# Altium project Prototipo1.PrjPcb
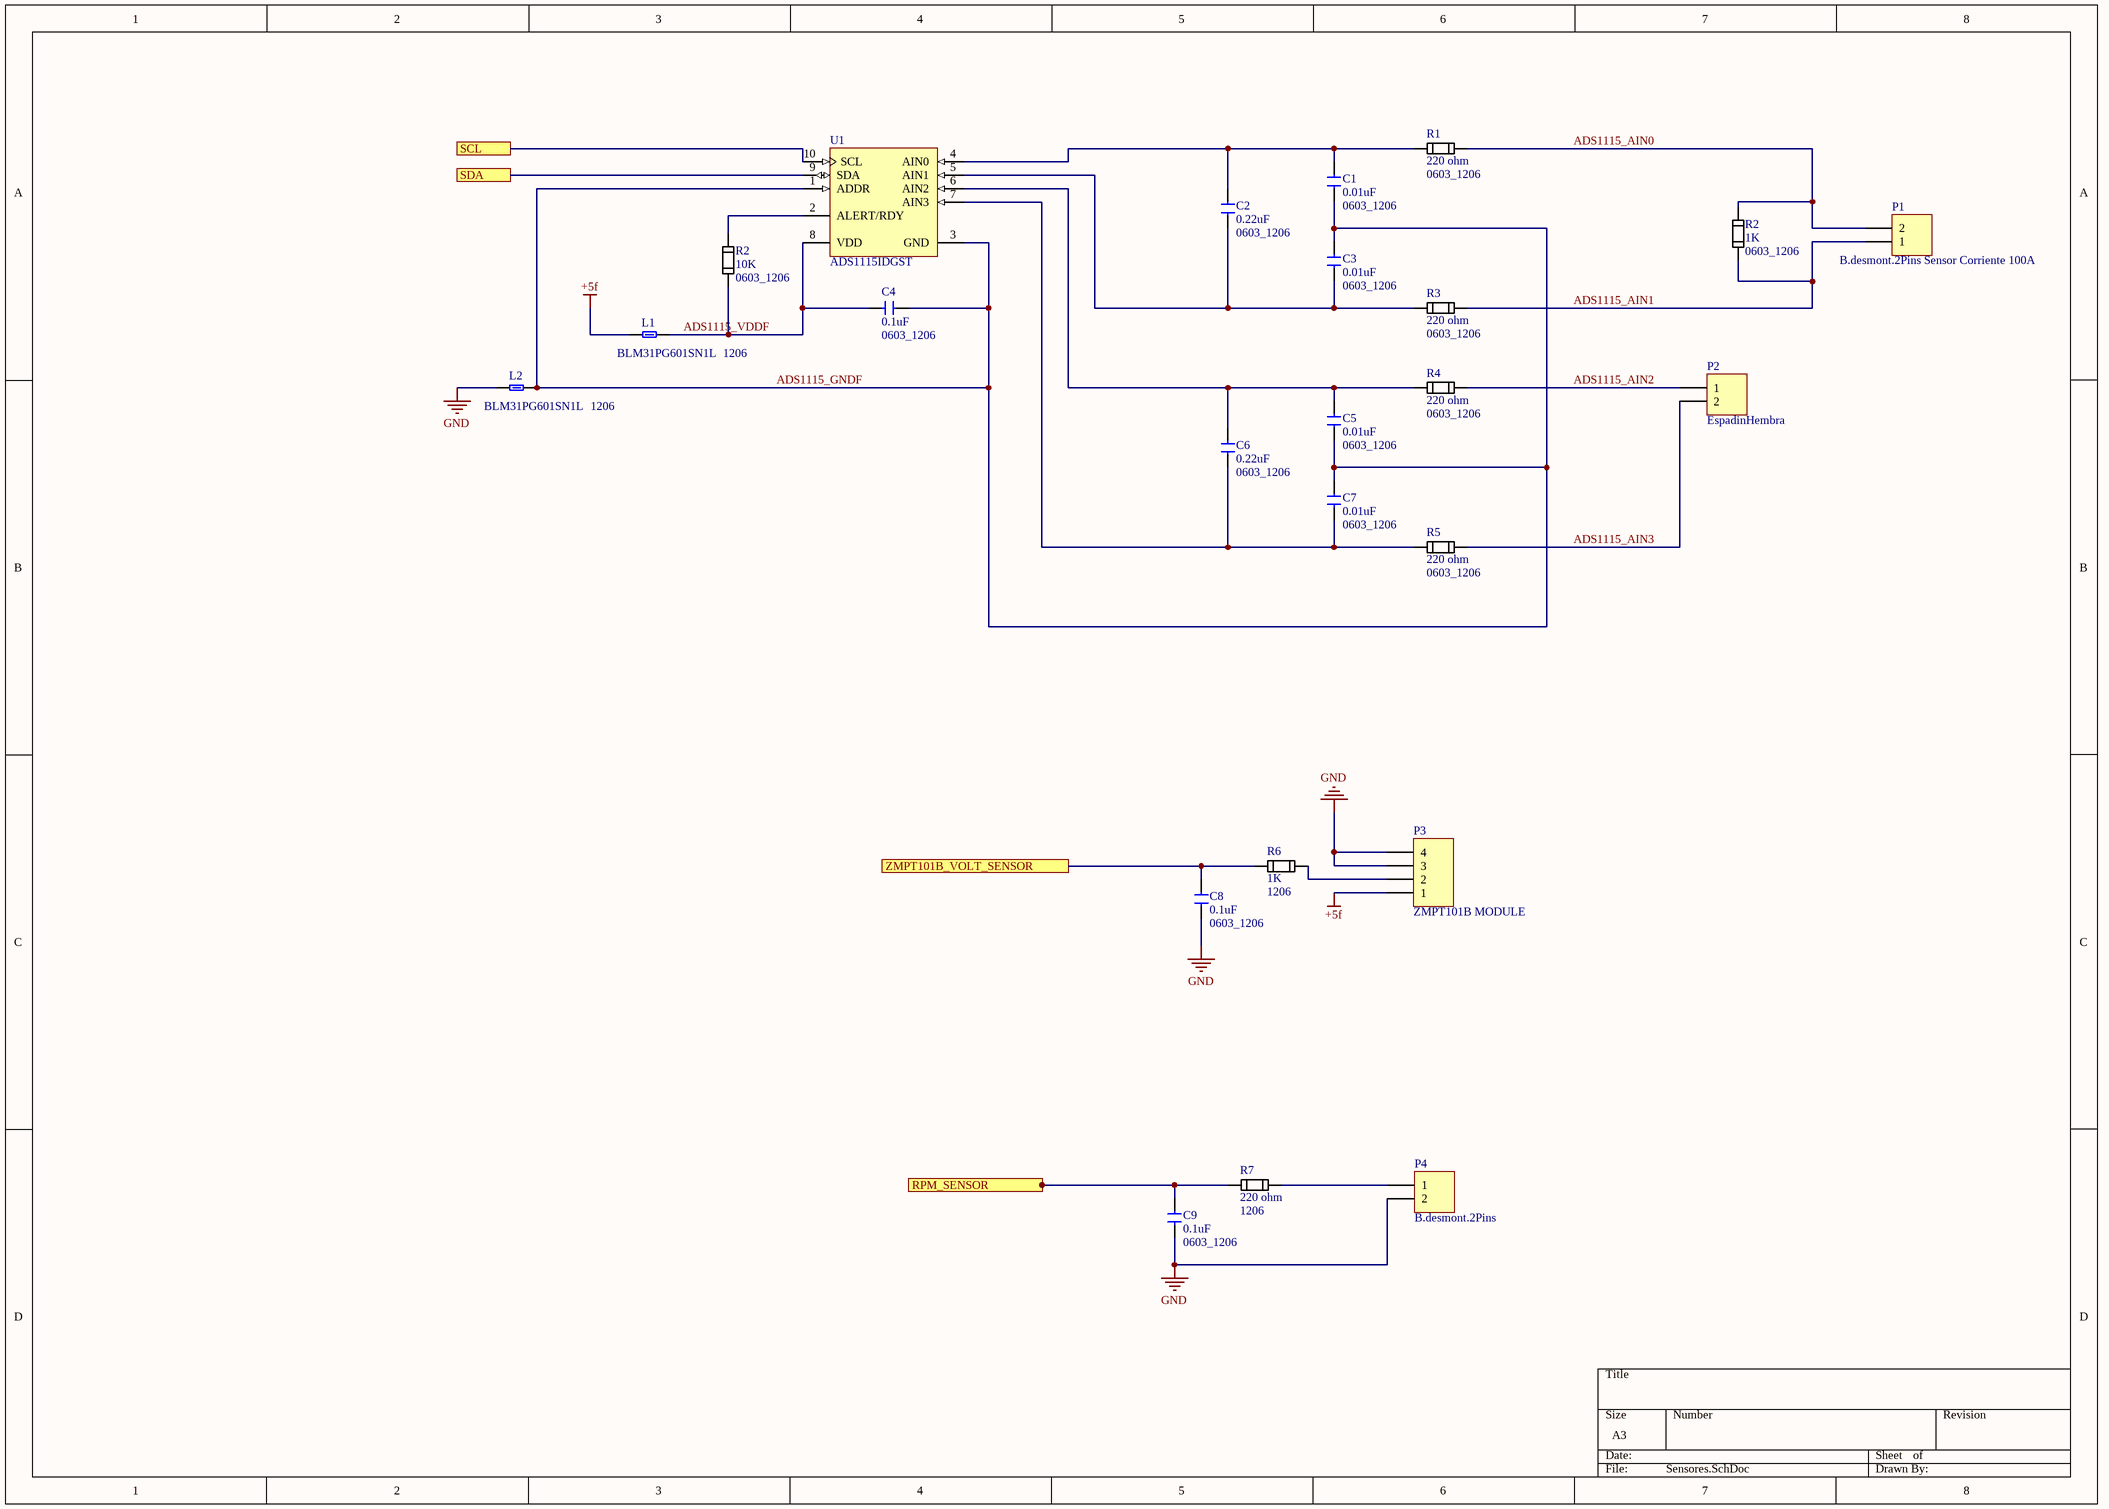
[diagram p0: Sensores.SchDoc]
6 sheets, 129 parts. Net scope: global (net labels, ports and power ports of the same name join across sheets).
Board file: Prototipo1A.PcbDoc
Sheets:
  Sensores.SchDoc
  uController.SchDoc
  SensorTemperatura.SchDoc
  Relay.SchDoc
  PowerSupply.SchDoc
  MAX3232.SchDoc

## Sheet Sensores.SchDoc
size A3

### Parts
(Parts that share a designator on the sheet are numbered #1, #2 ... from top to bottom, then left to right.)
C1  0.01uF  value 0603_1206  [SMD_CHIP_CAP_CER_0603_TO_1206]
C2  0.22uF  value 0603_1206  [SMD_CHIP_CAP_CER_0603_TO_1206]
C3  0.01uF  value 0603_1206  [SMD_CHIP_CAP_CER_0603_TO_1206]
C4  0.1uF  value 0603_1206  [SMD_CHIP_CAP_CER_0603_TO_1206]
C5  0.01uF  value 0603_1206  [SMD_CHIP_CAP_CER_0603_TO_1206]
C6  0.22uF  value 0603_1206  [SMD_CHIP_CAP_CER_0603_TO_1206]
C7  0.01uF  value 0603_1206  [SMD_CHIP_CAP_CER_0603_TO_1206]
C8  0.1uF  value 0603_1206  [SMD_CHIP_CAP_CER_0603_TO_1206]
C9  0.1uF  value 0603_1206  [SMD_CHIP_CAP_CER_0603_TO_1206]
L1  BLM31PG601SN1L  value 1206  [SMD_CHIP_FERRITE_1206]
L2  BLM31PG601SN1L  value 1206  [SMD_CHIP_FERRITE_1206]
P1  B.desmont.2Pins Sensor Corriente 100A  [KF2EDGV/R-2P]
P2  EspadinHembra  [HDR1X2]
P3  ZMPT101B MODULE  [ZMPT101B_MODULE]
P4  B.desmont.2Pins  [KF2EDGV/R-2P]
R1  220 ohm  value 0603_1206  [SMD_CHIP_RESISTOR_0603_TO_1206]
R2#1  1K  value 0603_1206  [SMD_CHIP_RESISTOR_0603_TO_1206]
R2#2  10K  value 0603_1206  [SMD_CHIP_RESISTOR_0603_TO_1206]
R3  220 ohm  value 0603_1206  [SMD_CHIP_RESISTOR_0603_TO_1206]
R4  220 ohm  value 0603_1206  [SMD_CHIP_RESISTOR_0603_TO_1206]
R5  220 ohm  value 0603_1206  [SMD_CHIP_RESISTOR_0603_TO_1206]
R6  1K  value 1206  [SMD_CHIP_RESISTOR_1206]
R7  220 ohm  value 1206  [SMD_CHIP_RESISTOR_1206]
U1  ADS1115IDGST  [TI-DGS10_L]

### Ports
RPM_SENSOR, SCL, SDA, ZMPT101B_VOLT_SENSOR

### Nets
+5f: L1.1 P3.1
GND: C8.1 C9.1 L2.1 P3.3 P3.4 P4.2
ADS1115_AIN0: P1.2 R1.2 R2#1.2
ADS1115_AIN1: P1.1 R2#1.1 R3.2
ADS1115_AIN2: P2.1 R4.2
ADS1115_AIN3: P2.2 R5.2
ADS1115_GNDF: C1.1 C3.2 C4.1 C5.1 C7.2 L2.2 U1.1(ADDR) U1.3(GND)
ADS1115_VDDF: C4.2 L1.2 R2#2.1 U1.8(VDD)
RPM_SENSOR: C9.2 R7.1 ; port RPM_SENSOR
SCL: U1.10(SCL) ; port SCL
SDA: U1.9(SDA) ; port SDA
ZMPT101B_VOLT_SENSOR: C8.2 R6.1 ; port ZMPT101B_VOLT_SENSOR
NetC1_2: C1.2 C2.2 R1.1 U1.4(AIN0)
NetC2_1: C2.1 C3.1 R3.1 U1.5(AIN1)
NetC5_2: C5.2 C6.2 R4.1 U1.6(AIN2)
NetC6_1: C6.1 C7.1 R5.1 U1.7(AIN3)
NetP3_2: P3.2 R6.2
NetP4_1: P4.1 R7.2
NetR2#2_2: R2#2.2 U1.2(ALERT/RDY)

### Library data of the parts
C1-C9 = SMD_CHIP_CAP_CER_0603_TO_1206
L1 L2 = CHIP_FERRITE_BEAD_INDUCTOR_1206: Chip Ferrite Bead Inductor
P1 P2 P4 = Header 2: Header, 2-Pin; LatestRevisionDate: 17-Jul-2002; LatestRevisionNote: Re-released for DXP Platform.; Publisher: Altium Limited
P3 = Header 4: Header, 4-Pin; LatestRevisionDate: 17-Jul-2002; LatestRevisionNote: Re-released for DXP Platform.; Publisher: Altium Limited
R1 R2#1 R2#2 R3-R5 = SMD_CHIP_RESISTOR_0603_TO_1206
R6 R7 = SMD_CHIP_RESISTOR_1206
U1 = CMP-0003-00378-2: 16-Bit ADC with Integrated Multiplexer, PGA, Comparator, Oscillator, and Reference, -40 to 125 degC, 10-pin SOP (DGS10), Green (RoHS & no Sb/Br); Manufacturer: Texas Instruments; Sample Rate (max)(SPS): 860; SubFamily: Precision ADC (<=10MSPS); Architecture: Delta-Sigma; Digital Supply(Min)(V): 2; Resolution(Bits): 16; Digital Supply(Max)(V): 5.5; INL(Max)(+/-LSB): 1; Interface: Serial I2C; # Input Channels: 4; Eco-Plan: Green (RoHS & no Sb/Br); PackageDescription: 10-Pin Plastic Small Outline, Body 3 x 3 mm, Pitch 0.5 mm; Mounting Technology: Surface Mount; PackageReference: DGS10; DatasheetVersion: SBAS444B; ComponentLink3Description: Package Specification; ComponentLink1Description: Manufacturer URL; PartNumber: ADS1115IDGST; ComponentLink3URL: http://www.ti.com/lit/ml/mpds035b/mpds035b.pdf; ComponentLink2URL: http://www.ti.com/general/docs/lit/getliterature.tsp?genericPartNumber=ADS1115&fileType=pdf; Analog Voltage AV/DD(Min)(V): 2; ComponentLink2Description: Datasheet; PackageVersion: 4073272/C, 02/2004; Analog Voltage AV/DD(Max)(V): 5.5; Code_JEDEC: MO-153; ComponentLink1URL: http://www.ti.com/

## Sheet uController.SchDoc
size A3
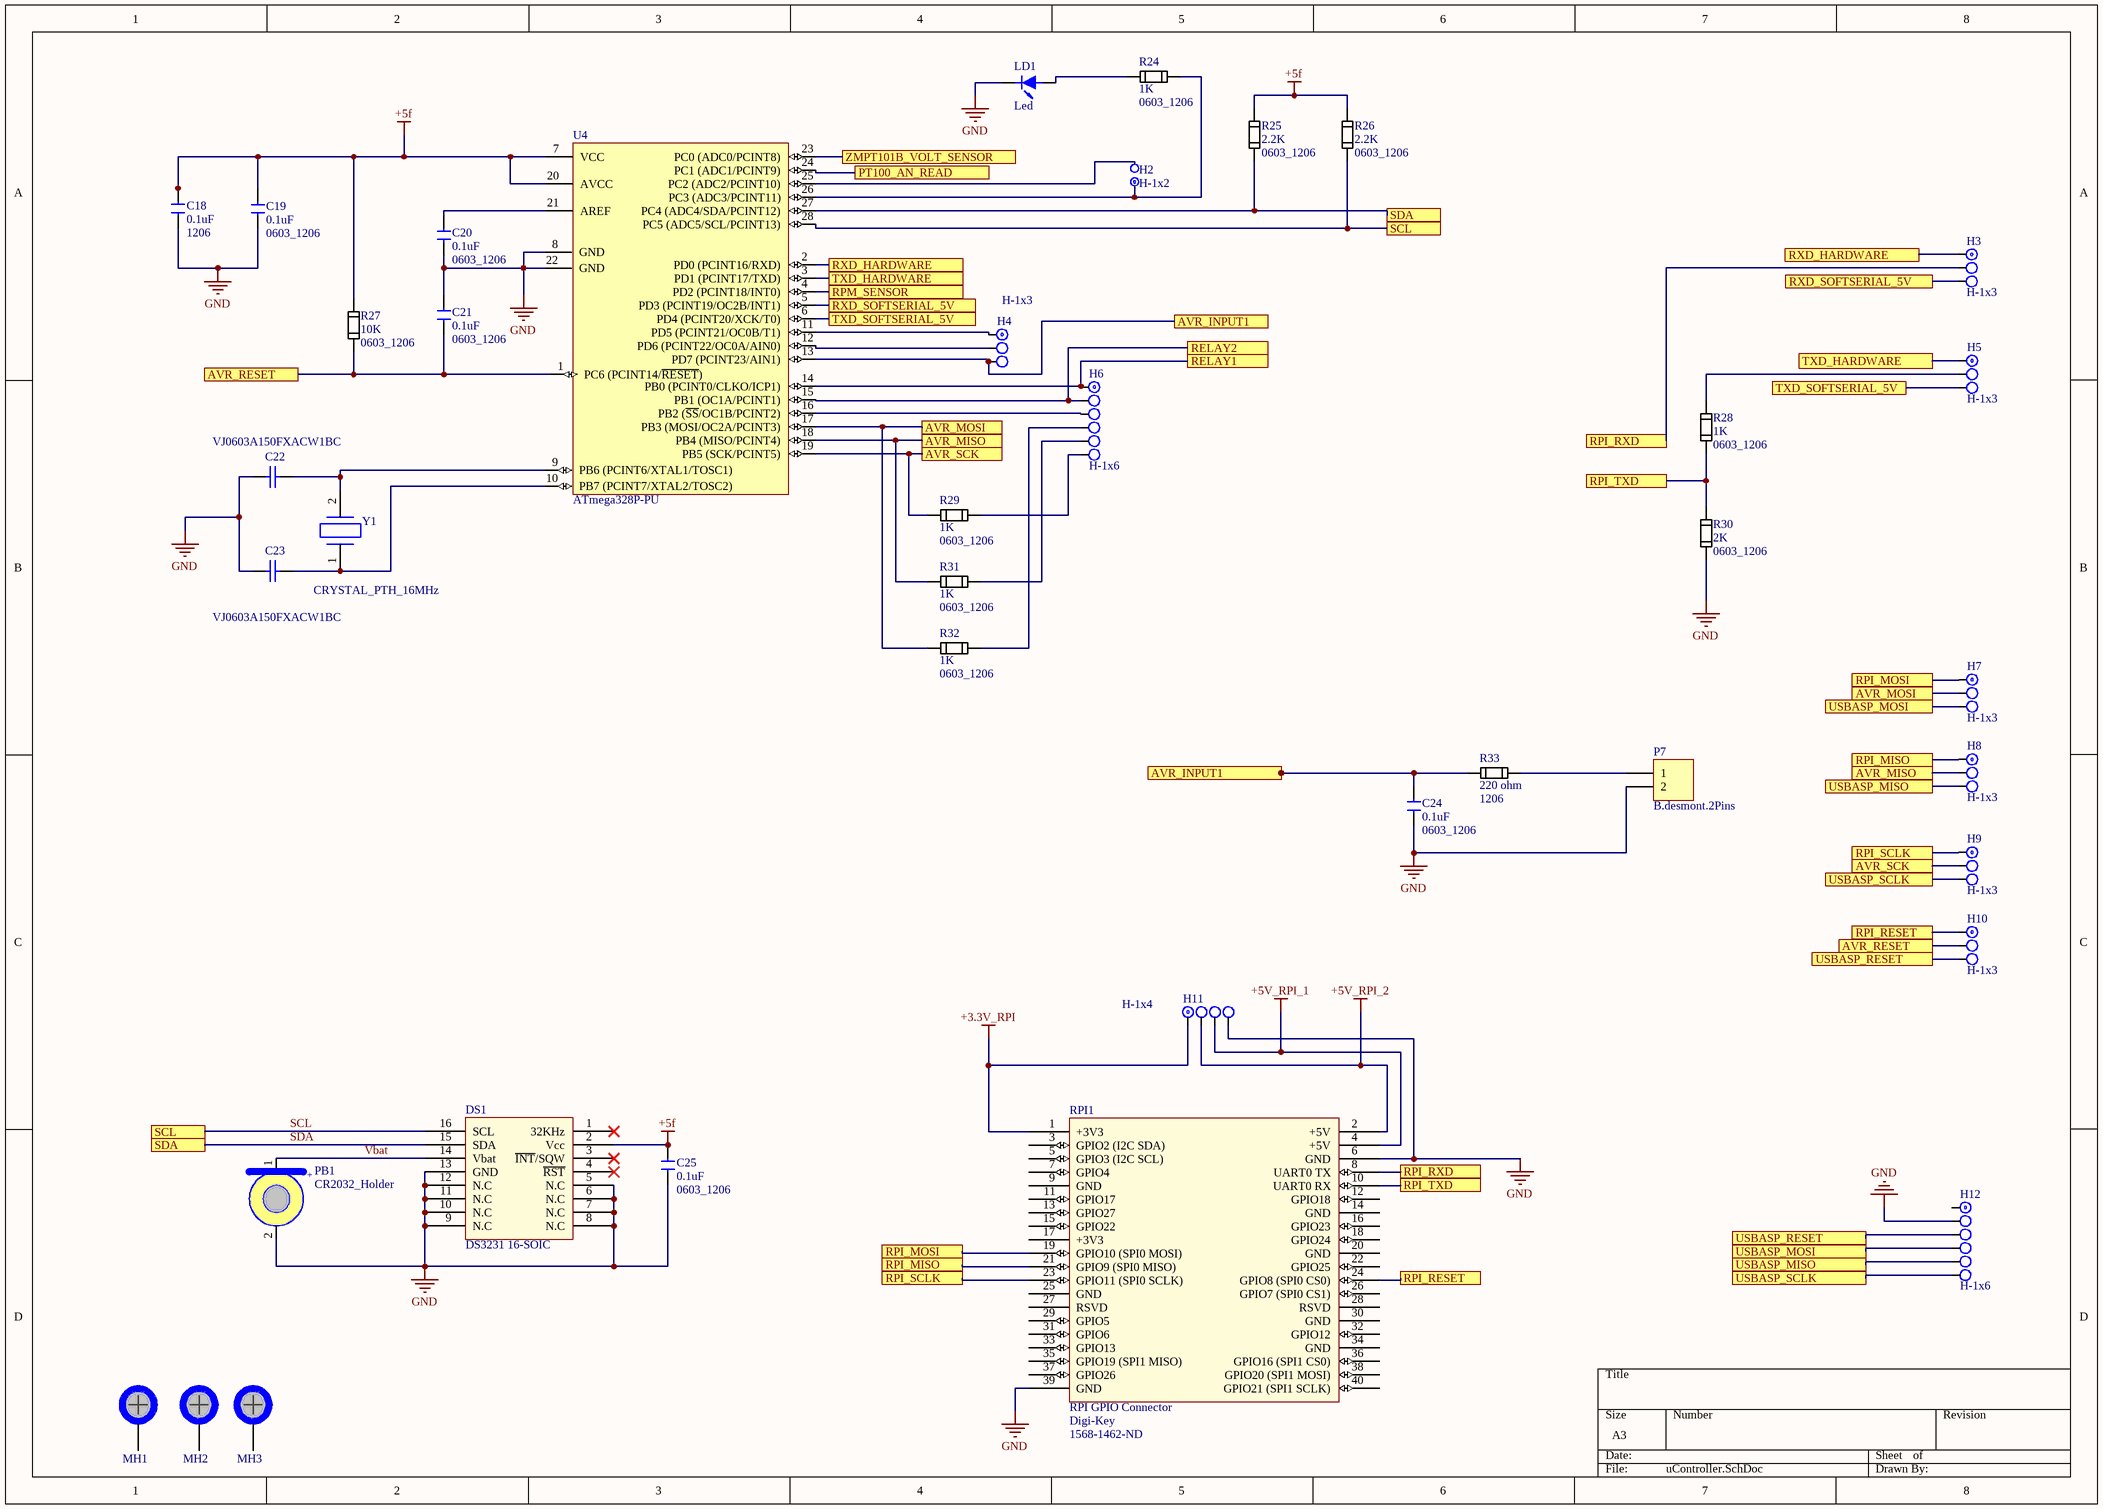
[diagram p1: uController.SchDoc]

### Parts
C18  0.1uF  value 1206  [SMD_CHIP_Cap_Cer_1206]
C19  0.1uF  value 0603_1206  [SMD_CHIP_CAP_CER_0603_TO_1206]
C20  0.1uF  value 0603_1206  [SMD_CHIP_CAP_CER_0603_TO_1206]
C21  0.1uF  value 0603_1206  [SMD_CHIP_CAP_CER_0603_TO_1206]
C22  VJ0603A150FXACW1BC  [CAPC1608X95X40ML15T15]
C23  VJ0603A150FXACW1BC  [CAPC1608X95X40ML15T15]
C24  0.1uF  value 0603_1206  [SMD_CHIP_CAP_CER_0603_TO_1206]
C25  0.1uF  value 0603_1206  [SMD_CHIP_CAP_CER_0603_TO_1206]
DS1  DS3231 16-SOIC  [SOIC127P1030X265-16N]
H2  H-1x2  [J1x2]
H3  H-1x3  [J1x3]
H4  H-1x3  [J1x3]
H5  H-1x3  [J1x3]
H6  H-1x6  [J1x6]
H7  H-1x3  [J1x3]
H8  H-1x3  [J1x3]
H9  H-1x3  [J1x3]
H10  H-1x3  [J1x3]
H11  H-1x4  [J1x4]
H12  H-1x6  [J1x6]
LD1  Led  [Led d5mm]
MH1  MH Pin - 5.5Pad - 3.3drill  [MH Pin - 5.5Pad - 3.3drill]  (value not drawn)
MH2  MH Pin - 5.5Pad - 3.3drill  [MH Pin - 5.5Pad - 3.3drill]  (value not drawn)
MH3  MH Pin - 5.5Pad - 3.3drill  [MH Pin - 5.5Pad - 3.3drill]  (value not drawn)
P7  B.desmont.2Pins  [KF2EDGV/R-2P]
PB1  CR2032_Holder  [CR2032]
R24  1K  value 0603_1206  [SMD_CHIP_RESISTOR_0603_TO_1206]
R25  2.2K  value 0603_1206  [SMD_CHIP_RESISTOR_0603_TO_1206]
R26  2.2K  value 0603_1206  [SMD_CHIP_RESISTOR_0603_TO_1206]
R27  10K  value 0603_1206  [SMD_CHIP_RESISTOR_0603_TO_1206]
R28  1K  value 0603_1206  [SMD_CHIP_RESISTOR_0603_TO_1206]
R29  1K  value 0603_1206  [SMD_CHIP_RESISTOR_0603_TO_1206]
R30  2K  value 0603_1206  [SMD_CHIP_RESISTOR_0603_TO_1206]
R31  1K  value 0603_1206  [SMD_CHIP_RESISTOR_0603_TO_1206]
R32  1K  value 0603_1206  [SMD_CHIP_RESISTOR_0603_TO_1206]
R33  220 ohm  value 1206  [SMD_CHIP_RESISTOR_1206]
RPI1  RPI GPIO Connector  Supplier 1: Digi-Key  Supplier Part Number 1: 1568-1462-ND  [rpi]
U4  ATmega328P-PU  [28P3]
Y1  CRYSTAL_PTH_16MHz  [Crystal PTH HC49LT, THT, 16MHz]

### Ports
AVR_INPUT1, AVR_MISO, AVR_MOSI, AVR_RESET, AVR_SCK, PT100_AN_READ, RELAY1, RELAY2, RPI_MISO, RPI_MOSI, RPI_RESET, RPI_RXD, RPI_SCLK, RPI_TXD, RPM_SENSOR, RXD_HARDWARE, RXD_SOFTSERIAL_5V, SCL, SDA, TXD_HARDWARE, TXD_SOFTSERIAL_5V, USBASP_MISO, USBASP_MOSI, USBASP_RESET, USBASP_SCLK, ZMPT101B_VOLT_SENSOR

### Nets
+3.3V_RPI: H11.1 RPI1.1(+3V3)
+5f: C18.2 C19.1 C25.2 DS1.2(Vcc) R25.2 R26.2 R27.2 U4.7(VCC) U4.20(AVCC)
+5V_RPI_1: H11.3 RPI1.4(+5V)
+5V_RPI_2: H11.2 RPI1.2(+5V)
GND: C18.1 C19.2 C20.2 C21.1 C22.1 C23.1 C24.1 C25.1 DS1.5(N.C) DS1.6(N.C) DS1.7(N.C) DS1.8(N.C) DS1.9(N.C) DS1.10(N.C) DS1.11(N.C) DS1.12(N.C) DS1.13(GND) H11.4 H12.2 LD1.2(K) P7.2 PB1.2 R30.1 RPI1.6(GND) RPI1.39(GND) U4.8(GND) U4.22(GND)
AVR_INPUT1: C24.2 H4.3 R33.1 U4.13(PD7_(PCINT23/AIN1)) ; port AVR_INPUT1
AVR_MISO: H8.2 R31.2 U4.18(PB4_(MISO/PCINT4)) ; port AVR_MISO
AVR_MOSI: H7.2 R32.2 U4.17(PB3_(MOSI/OC2A/PCINT3)) ; port AVR_MOSI
AVR_RESET: C21.2 H10.2 R27.1 U4.1(PC6_(PCINT14/~{RESET})) ; port AVR_RESET
AVR_SCK: H9.2 R29.2 U4.19(PB5_(SCK/PCINT5)) ; port AVR_SCK
PT100_AN_READ: U4.24(PC1_(ADC1/PCINT9)) ; port PT100_AN_READ
RELAY1: H6.1 U4.14(PB0_(PCINT0/CLKO/ICP1)) ; port RELAY1
RELAY2: H6.2 U4.15(PB1_(OC1A/PCINT1)) ; port RELAY2
RPI_MISO: H8.1 RPI1.21(GPIO9_(SPI0_MISO)) ; port RPI_MISO
RPI_MOSI: H7.1 RPI1.19(GPIO10_(SPI0_MOSI)) ; port RPI_MOSI
RPI_RESET: H10.1 RPI1.24(GPIO8_(SPI0_CS0)) ; port RPI_RESET
RPI_RXD: H3.2 RPI1.8(UART0_TX) ; port RPI_RXD
RPI_SCLK: H9.1 RPI1.23(GPIO11_(SPI0_SCLK)) ; port RPI_SCLK
RPI_TXD: R28.1 R30.2 RPI1.10(UART0_RX) ; port RPI_TXD
RPM_SENSOR: U4.4(PD2_(PCINT18/INT0)) ; port RPM_SENSOR
RXD_HARDWARE: H3.1 U4.2(PD0_(PCINT16/RXD)) ; port RXD_HARDWARE
RXD_SOFTSERIAL_5V: H3.3 U4.5(PD3_(PCINT19/OC2B/INT1)) ; port RXD_SOFTSERIAL_5V
SCL: DS1.16(SCL) R26.1 U4.28(PC5_(ADC5/SCL/PCINT13)) ; port SCL
SDA: DS1.15(SDA) R25.1 U4.27(PC4_(ADC4/SDA/PCINT12)) ; port SDA
TXD_HARDWARE: H5.1 U4.3(PD1_(PCINT17/TXD)) ; port TXD_HARDWARE
TXD_SOFTSERIAL_5V: H5.3 U4.6(PD4_(PCINT20/XCK/T0)) ; port TXD_SOFTSERIAL_5V
USBASP_MISO: H8.3 H12.5 ; port USBASP_MISO
USBASP_MOSI: H7.3 H12.4 ; port USBASP_MOSI
USBASP_RESET: H10.3 H12.3 ; port USBASP_RESET
USBASP_SCLK: H9.3 H12.6 ; port USBASP_SCLK
Vbat: DS1.14(Vbat) PB1.1
ZMPT101B_VOLT_SENSOR: U4.23(PC0_(ADC0/PCINT8)) ; port ZMPT101B_VOLT_SENSOR
NetC20_1: C20.1 U4.21(AREF)
NetC22_2: C22.2 U4.9(PB6_(PCINT6/XTAL1/TOSC1)) Y1.2
NetC23_2: C23.2 U4.10(PB7_(PCINT7/XTAL2/TOSC2)) Y1.1
NetH2_1: H2.1 R24.1 U4.26(PC3_(ADC3/PCINT11))
NetH2_2: H2.2 U4.25(PC2_(ADC2/PCINT10))
NetH4_1: H4.1 U4.11(PD5_(PCINT21/OC0B/T1))
NetH4_2: H4.2 U4.12(PD6_(PCINT22/OC0A/AIN0))
NetH5_2: H5.2 R28.2
NetH6_3: H6.3 U4.16(PB2_(~{SS}/OC1B/PCINT2))
NetH6_4: H6.4 R32.1
NetH6_5: H6.5 R31.1
NetH6_6: H6.6 R29.1
NetLD1_1: LD1.1(A) R24.2
NetP7_1: P7.1 R33.2

Not connected (* = marked no-connect by the designer): DS1 1(32KHz)* 3(~{INT}/SQW)* 4(~{RST})*; H12 1; MH1 1(Grounding); MH2 1(Grounding); MH3 1(Grounding); RPI1 3(GPIO2_(I2C_SDA)) 5(GPIO3_(I2C_SCL)) 7(GPIO4) 9(GND) 11(GPIO17) 12(GPIO18) 13(GPIO27) 14(GND) 15(GPIO22) 16(GPIO23) 17(+3V3) 18(GPIO24) 20(GND) 22(GPIO25) 25(GND) 26(GPIO7_(SPI0_CS1)) 27(RSVD) 28(RSVD) 29(GPIO5) 30(GND) 31(GPIO6) 32(GPIO12) 33(GPIO13) 34(GND) 35(GPIO19_(SPI1_MISO)) 36(GPIO16_(SPI1_CS0)) 37(GPIO26) 38(GPIO20_(SPI1_MOSI)) 40(GPIO21_(SPI1_SCLK))

### Notes on the sheet
- (in symbol CR2032_Holder) +

### Library data of the parts
C18 = SMD_CHIP_CAP_CER_1206
C19-C21 C24 C25 = SMD_CHIP_CAP_CER_0603_TO_1206
C22 C23 = CMP-2006-01814-1: Manufacturer: Vitramon; Part Number: VJ0603A150FXACW1BC
DS1 = DS3231: SOIC, 16-Leads, Body 10.5x7.5mm (max), Pitch 1.27mm, IPC Medium Density
LD1 = Led-5mm: 5mm; Price: 0.05
P7 = Header 2: Header, 2-Pin; LatestRevisionDate: 17-Jul-2002; LatestRevisionNote: Re-released for DXP Platform.; Publisher: Altium Limited
R24-R32 = SMD_CHIP_RESISTOR_0603_TO_1206
R33 = SMD_CHIP_RESISTOR_1206
RPI1 = rpi connector: GPIO Header for Raspberry Pi A+/B+/Pi 2/Pi 3 - 2x20; Manufacturer: SparkFun Electronics; Manufacturer Part Number: PRT-14017; Nils Minor: author; nilsminor@web.de: mail; RoHS: RoHS Compliant; Category: Development Boards, Kits, Programmers; Stock 1: 150; Pricing 1: 1=1.84 (EUR); Part Status: Active; Accessory Type: Connector; For Use With/Related Products: Raspberry Pi; ComponentLink1URL: https://cdn.sparkfun.com/datasheets/Dev/RaspberryPi/12313.pdf; ComponentLink1Description: https://cdn.sparkfun.com/datasheets/Dev/RaspberryPi/12313.pdf
U4 = CMP-0095-00013-2: 8-bit AVR Microcontroller, 32KB Flash, 1KB EEPROM, 2KB SRAM, 28-pin PDIP, Industrial Grade (-40°C to 85°C); RevisionNote: DatasheetVersion updated. URLs added.; PackageVersion: revB, Sep-2001; PackageDescription: 28-lead (0.300"/7.62mm Wide) Plastic Dual Inline Package (PDIP); DatasheetVersion: revD, May-2011; ComponentLink1Description: Manufacturer URL; ComponentLink1URL: http://www.atmel.com/; PackageReference: 28P3; ComponentLink2Description: ATmega48A/48PA/88A/88PA/168A/168PA/328/328P Datasheet; ComponentLink3URL: http://www.atmel.com/dyn/resources/prod_documents/8271S.pdf; ComponentLink2URL: http://www.atmel.com/dyn/resources/prod_documents/8271.pdf; ComponentLink3Description: ATmega48A/48PA/88A/88PA/168A/168PA/328/328P Summary
H2 = H-1x2: Price: 0.02
H3-H5 H7-H10 = H-1x3: Price: 0.03
H6 H12 = H-1x6: Price: 0.06
H11 = H-1x4: Price: 0.04

## Sheet SensorTemperatura.SchDoc
size A4
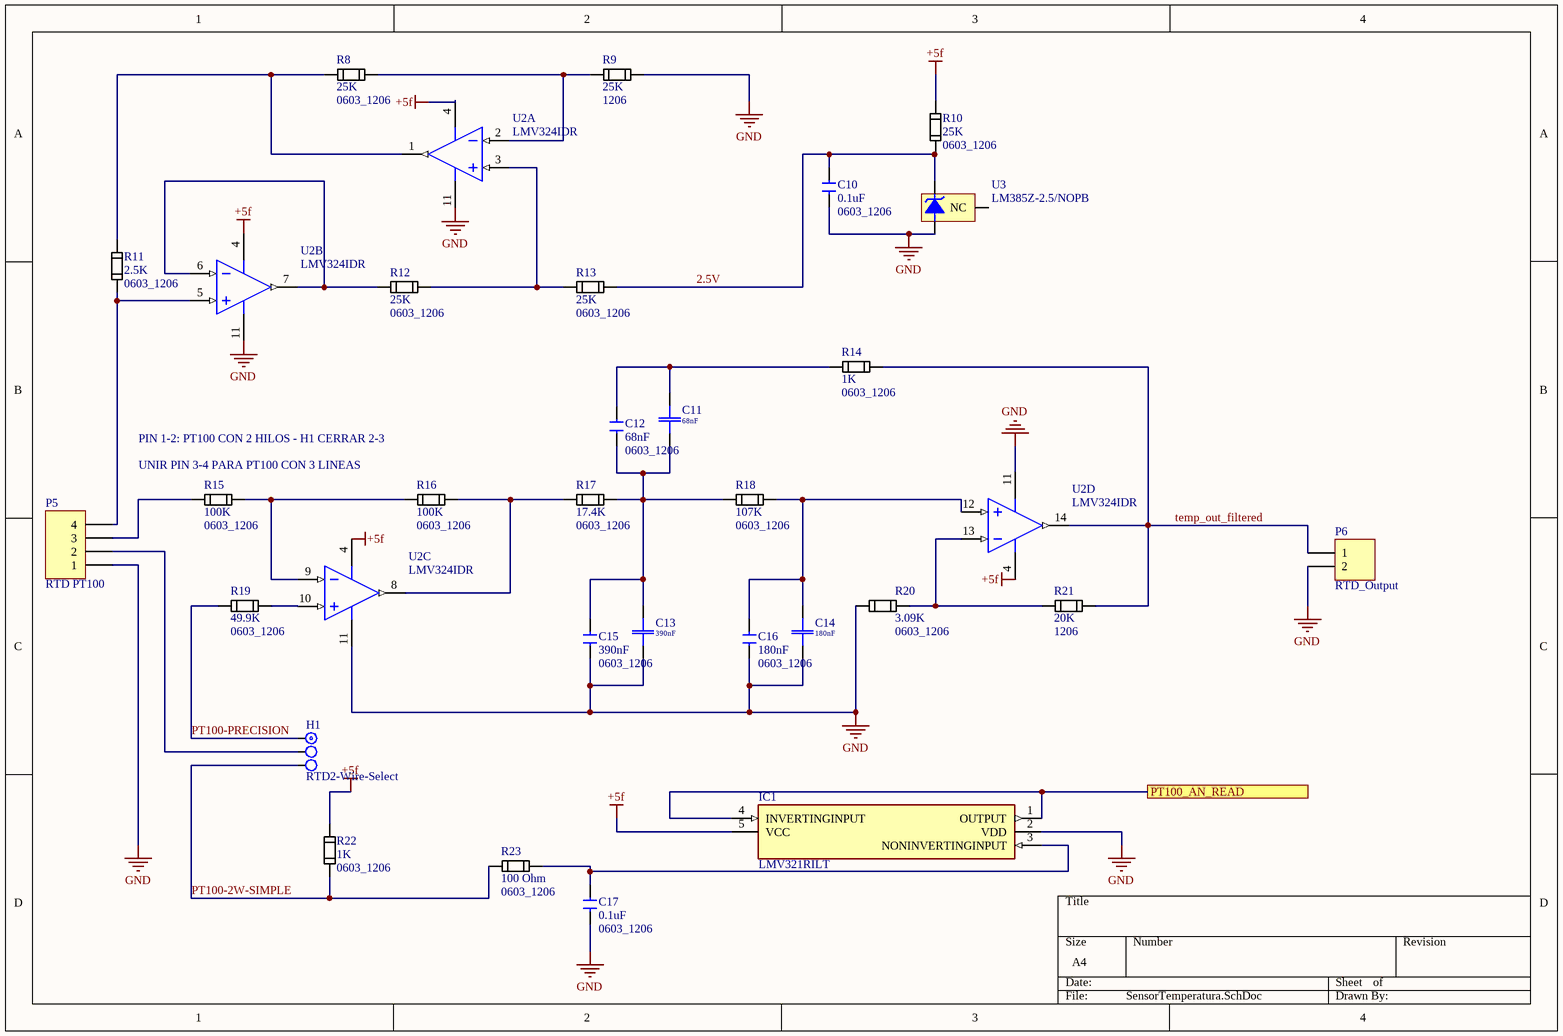
[diagram p2: SensorTemperatura.SchDoc]

### Parts
C10  0.1uF  value 0603_1206  [SMD_CHIP_CAP_CER_0603_TO_1206]
C11  68nF  [Cap-Disk-D5.5-R5.08]
C12  68nF  value 0603_1206  [SMD_CHIP_CAP_CER_0603_TO_1206]
C13  390nF  [Cap-Disk-D5.5-R5.08]
C14  180nF  [Cap-Disk-D5.5-R5.08]
C15  390nF  value 0603_1206  [SMD_CHIP_CAP_CER_0603_TO_1206]
C16  180nF  value 0603_1206  [SMD_CHIP_CAP_CER_0603_TO_1206]
C17  0.1uF  value 0603_1206  [SMD_CHIP_CAP_CER_0603_TO_1206]
H1  RTD2-Wire-Select  [J1x3]
IC1  LMV321RILT  [SOT95P280X145-5N]
P5  RTD PT100  [KF2EDGV/R-4P]
P6  RTD_Output  [HDR1X2]
R8  25K  value 0603_1206  [SMD_CHIP_RESISTOR_1206]
R9  25K  value 1206  [SMD_CHIP_RESISTOR_1206]
R10  25K  value 0603_1206  [SMD_CHIP_RESISTOR_0603_TO_1206]
R11  2.5K  value 0603_1206  [SMD_CHIP_RESISTOR_1206]
R12  25K  value 0603_1206  [SMD_CHIP_RESISTOR_1206]
R13  25K  value 0603_1206  [SMD_CHIP_RESISTOR_1206]
R14  1K  value 0603_1206  [SMD_CHIP_RESISTOR_0603_TO_1206]
R15  100K  value 0603_1206  [SMD_CHIP_RESISTOR_1206]
R16  100K  value 0603_1206  [SMD_CHIP_RESISTOR_1206]
R17  17.4K  value 0603_1206  [SMD_CHIP_RESISTOR_1206]
R18  107K  value 0603_1206  [SMD_CHIP_RESISTOR_1206]
R19  49.9K  value 0603_1206  [SMD_CHIP_RESISTOR_1206]
R20  3.09K  value 0603_1206  [SMD_CHIP_RESISTOR_1206]
R21  20K  value 1206  [SMD_CHIP_RESISTOR_1206]
R22  1K  value 0603_1206  [SMD_CHIP_RESISTOR_1206]
R23  100 Ohm  value 0603_1206  [SMD_CHIP_RESISTOR_1206]
U2  LMV324IDR  [D0014A_V]  (parts A,B,C,D of 4)
U3  LM385Z-2.5/NOPB  [Z03A]

### Ports
PT100_AN_READ

### Nets
+5f: IC1.5(VCC) R10.2 R22.2 U2.4(VCC+)
GND: C10.1 C13.2 C14.2 C15.1 C16.1 C17.1 IC1.2(VDD) P5.1 P6.2 R9.2 R20.1 U2.11(GND) U3.3(-V)
2.5V: C10.2 R10.1 R13.2 U3.2(+V)
PT100-2W-SIMPLE: H1.3 R22.1 R23.2
PT100-PRECISION: H1.1 R19.1
PT100_AN_READ: IC1.1(OUTPUT) IC1.4(INVERTINGINPUT) ; port PT100_AN_READ
temp_out_filtered: P6.1 R14.2 R21.2 U2.14(4OUT)
NetC11_1: C11.1 C12.2 R14.1
NetC11_2: C11.2 C12.1 C13.1 C15.2 R17.2 R18.1
NetC14_1: C14.1 C16.2 R18.2 U2.12(4IN+)
NetC17_2: C17.2 IC1.3(NONINVERTINGINPUT) R23.1
NetH1_2: H1.2 P5.2
NetP5_3: P5.3 R15.1
NetP5_4: P5.4 R11.1 U2.5(2IN+)
NetR8_1: R8.1 R11.2 U2.1(1OUT)
NetR8_2: R8.2 R9.1 U2.2(1IN-)
NetR12_1: R12.1 U2.6(2IN-) U2.7(2OUT)
NetR12_2: R12.2 R13.1 U2.3(1IN+)
NetR15_2: R15.2 R16.1 U2.9(3IN-)
NetR16_2: R16.2 R17.1 U2.8(3OUT)
NetR19_2: R19.2 U2.10(3IN+)
NetR20_2: R20.2 R21.1 U2.13(4IN-)

Not connected (* = marked no-connect by the designer): U3 1(NC)

### Notes on the sheet
- PIN 1-2: PT100 CON 2 HILOS - H1 CERRAR 2-3
- (near R15) UNIR PIN 3-4 PARA PT100 CON 3 LINEAS

### Library data of the parts
C10 C12 C15-C17 = SMD_CHIP_CAP_CER_0603_TO_1206
C11 C13 C14 = Cer Disc HV 820p 1kV: 820p 1kV Y5P; Tip: Suntan 820pF 1kV Y5P; Price: 0.072
  C11: Value: 68nF
  C13: Value: 390nF
  C14: Value: 180nF
H1 = H-1x3: Price: 0.03
IC1 = LMV321RILT: Integrated Circuit; Manufacturer_Name: STMicroelectronics; Allied_Number: 70390334; Datasheet Link: http://www.st.com/st-web-ui/static/active/en/resource/technical/document/datasheet/CD00079372.pdf; Height: 1.45mm; Manufacturer_Part_Number: LMV321RILT; Mouser Part Number: 511-LMV321RILT; Mouser Price/Stock: https://www.mouser.com/Search/Refine.aspx?Keyword=511-LMV321RILT; RS Part Number: 0426130P; RS Price/Stock: http://uk.rs-online.com/web/p/products/0426130P; Allied Price/Stock: http://www.alliedelec.com/stmicroelectronics-lmv321rilt/70390334/
P5 = Header 4: Header, 4-Pin; LatestRevisionDate: 17-Jul-2002; LatestRevisionNote: Re-released for DXP Platform.; Publisher: Altium Limited
P6 = Header 2: Header, 2-Pin; LatestRevisionDate: 17-Jul-2002; LatestRevisionNote: Re-released for DXP Platform.; Publisher: Altium Limited
R8 R10-R20 R22 R23 = SMD_CHIP_RESISTOR_0603_TO_1206
R9 R21 = SMD_CHIP_RESISTOR_1206
U2 = CMP-1685-00010-1: Quad Low-Voltage Rail-to-Rail Output Operational Amplifier, 2.7 to 5.5 V, -40 to 125 degC, 14-Pin SOIC (D), Green (RoHS & no Sb/Br), Tape and Reel; ComponentLink3Description: Package Specification; ComponentLink2URL: http://www.ti.com/lit/ds/symlink/lmv324.pdf; ComponentLink3URL: http://www.ti.com/lit/ml/mpds177g/mpds177g.pdf; DatasheetVersion: SLOS263W, 10/2014; ComponentLink1URL: http://www.ti.com/; Code_JEDEC: MS-012; ComponentLink1Description: Manufacturer URL; PackageDescription: 14-Pin Small Outline Integrated Circuit, Body 8.65 x 3.9 mm, Pitch 1.27 mm; PackageReference: D0014A; ComponentLink2Description: Datasheet
U3 = CMP-0074-00017-2: Micropower Voltage Reference Diode, 3-pin TO-92, Pb-Free; Manufacturer: National Semiconductor; CompType: Voltage Reference IC; PowerWise: N; PackageTopMarking: NSXYTT*LM385*Z2.5; DatasheetVersion: Jan-2008; PackageReference: Z03A; PackageDescription: TO-92, Molded, 3 Lead; PackageVersion: revG, Sep-2000; Code_JEDEC: TO-226-AA; ComponentLink3Description: Z03A Package Page; ComponentLink3URL: http://www.national.com/packaging/folders/z03a.html; RoHS: Y; ComponentLink1URL: http://www.national.com/ds/LM/LM385-2.5.pdf; ComponentLink2Description: LM385-2.5 Web Page; ComponentLink2URL: http://www.national.com/pf/LM/LM385-2.5.html; ComponentLink1Description: LM385-2.5 Datasheet; RevisionNote: Component URLs added; PinCount: 3

## Sheet Relay.SchDoc
size A
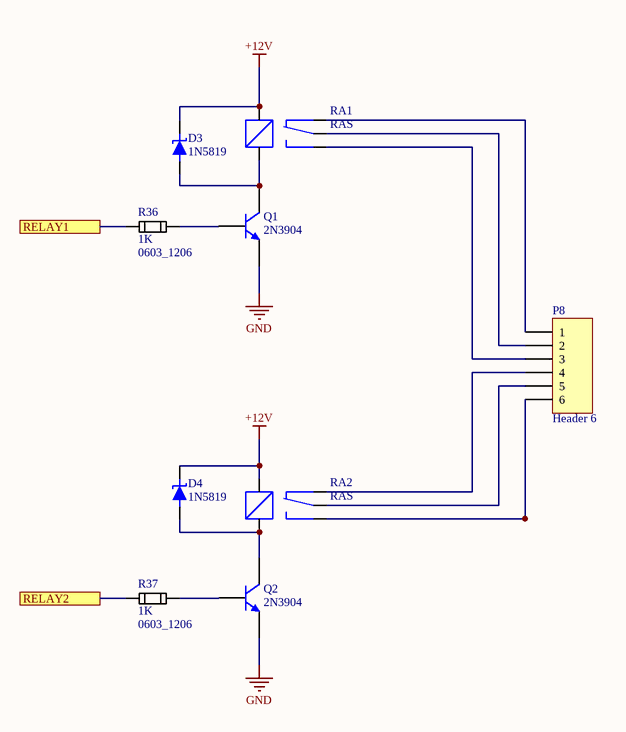
[diagram p3: Relay.SchDoc]

### Parts
D3  1N5819  [DO-41-300]
D4  1N5819  [DO-41-300]
P8  Header 6  [KF2EDGV/R-6P]
Q1  2N3904  [TO-92A-Pitch100MILS]
Q2  2N3904  [TO-92A-Pitch100MILS]
R36  1K  value 0603_1206  [SMD_CHIP_RESISTOR_0603_TO_1206]
R37  1K  value 0603_1206  [SMD_CHIP_RESISTOR_0603_TO_1206]
RA1  RAS  [Rele RAS]
RA2  RAS  [Rele RAS]

### Ports
RELAY1, RELAY2

### Nets
+12V: D3.2(K) D4.2(K) RA1.1(a) RA2.1(a)
GND: Q1.1(E) Q2.1(E)
RELAY1: R36.2 ; port RELAY1
RELAY2: R37.2 ; port RELAY2
NetD3_1: D3.1(A) Q1.3(C) RA1.2(b)
NetD4_1: D4.1(A) Q2.3(C) RA2.2(b)
NetP8_1: P8.1 RA1.3(NC)
NetP8_2: P8.2 RA1.4(O)
NetP8_3: P8.3 RA1.5(NO)
NetP8_4: P8.4 RA2.3(NC)
NetP8_5: P8.5 RA2.4(O)
NetP8_6: P8.6 RA2.5(NO)
NetQ1_2: Q1.2(B) R36.1
NetQ2_2: Q2.2(B) R37.1

### Library data of the parts
D3 D4 = 1N5819: 40V 1A; Price: 0.07
P8 = Header 6: Header, 6-Pin; LatestRevisionDate: 17-Jul-2002; LatestRevisionNote: Re-released for DXP Platform.; Publisher: Altium Limited
Q1 Q2 = 2N3904: NPN General Purpose Amplifier; Published: 8-Jun-2000; LatestRevisionDate: 15-Jan-2003; LatestRevisionNote: PCB Footprint 'BCY-W3/D4.7' replaced; DatasheetVersion: 1997; PackageVersion: Sep-1998; PackageReference: TO-92A; Publisher: Altium Limited; PackageDescription: TO, Flat Index; 3 In-Line, Axial Leads; Body Dia. 4.5mm; Leads 0.51 x 0.48 mm (max); ComponentLink1Description: Manufacturer Link; ComponentLink1URL: http://www.fairchildsemi.com/; ComponentLink2Description: Datasheet; ComponentLink2URL: http://www.fairchildsemi.com/ds/2N%2F2N3904.pdf
R36 R37 = SMD_CHIP_RESISTOR_0603_TO_1206
RA1 RA2 = Relay RAS: AC-120V 15A DC-14V 20A 30V 15A /0.36W; Price: 1.8

## Sheet PowerSupply.SchDoc
size A
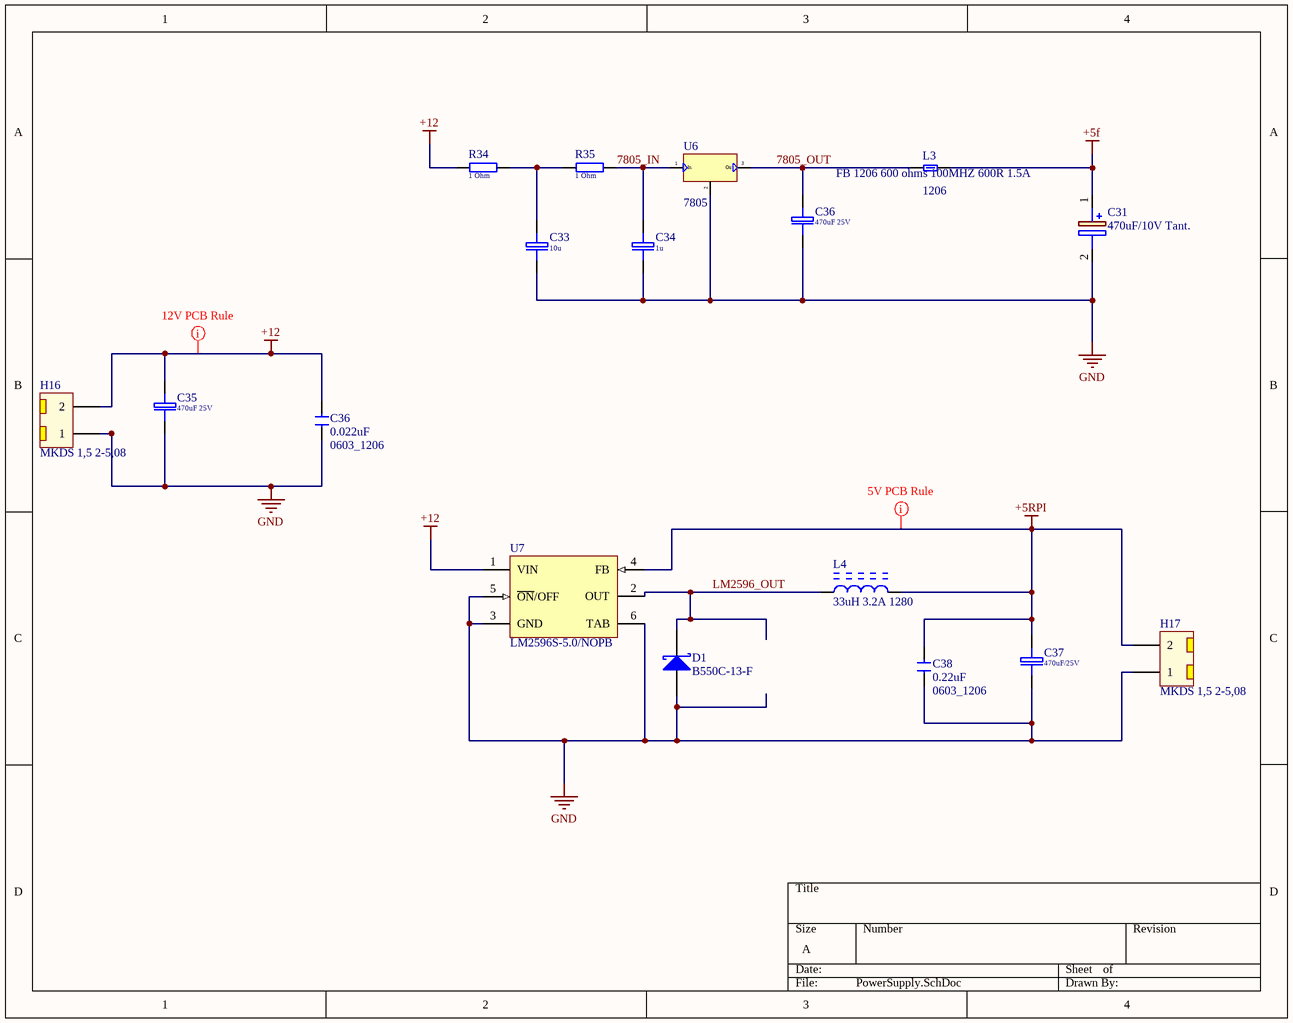
[diagram p4: PowerSupply.SchDoc]

### Parts
(Parts that share a designator on the sheet are numbered #1, #2 ... from top to bottom, then left to right.)
C31  470uF/10V Tant.  [SMD_2917]
C33  10u  [El-d5-h11-F2.54]
C34  1u  [El-d5-h11-F2.54]
C35  470uF 25V  [El-d8-h14-F3.81]
C36#1  470uF 25V  [El-d8-h14-F3.81]
C36#2  0.022uF  value 0603_1206  [SMD_CHIP_CAP_CER_0603_TO_1206]
C37  470uF/25V  [El-d8-h14-F3.81]
C38  0.22uF  value 0603_1206  [SMD_CHIP_CAP_CER_0603_TO_1206]
D1  B550C-13-F  [DIOD-SMC-2-A_V]
H16  MKDS 1,5 2-5,08  [MKDS 1,5 2-5,08]
H17  MKDS 1,5 2-5,08  [MKDS 1,5 2-5,08]
L3  FB 1206 600 ohms 100MHZ 600R 1.5A  value 1206  [SMD_CHIP_FERRITE_1206]
L4  33uH 3.2A 1280  [BOUR-SRR1280-2_V]
R34  1 Ohm  [R0.25-400]
R35  1 Ohm  [R0.25-400]
U6  7805  [TO 220_DISIPADOR_HORIZONTAL_2]
U7  LM2596S-5.0/NOPB  [KTT0005B_M]

### Nets
+5f: C31.1(+) L3.2
+5RPI: C37.1 C38.2 H17.2 L4.2 U7.4(FB)
+12: C35.1 C36#2.2 H16.2 R34.1 U7.1(VIN)
GND: C31.2(-) C33.2 C34.2 C35.2 C36#1.2 C36#2.1 C37.2 C38.1 D1.1(A) H16.1 H17.1 U6.2(G) U7.3(GND) U7.5(~{ON}/OFF) U7.6(TAB)
7805_IN: C34.1 R35.2 U6.1(In)
7805_OUT: C36#1.1 L3.1 U6.3(Ou)
LM2596_OUT: D1.2(K) L4.1 U7.2(OUT)
NetC33_1: C33.1 R34.2 R35.1

### Layout directives
rule Width Constraint [Pref Width = 2mm    Min Width = 0.254mm    Max Width = 3mm]; net class *; rule Clearance Constraint [Clearance = 0.3mm]: +5RPI
rule Width Constraint [Pref Width = 1mm    Min Width = 0.254mm    Max Width = 2mm]: +12

### Library data of the parts
C31 = SMD_2917: T495X477K010ATE100; Manufacturer_Name: Kemet; Allied_Number: 70610894; Datasheet Link: http://www.kemet.com/Lists/ProductCatalog/Attachments/261/KEM_T2009_T495.pdf; Height: 3.1mm; Manufacturer_Part_Number: T495X477K010ATE100; Mouser Part Number: 80-T495X477K10ATE100; Mouser Price/Stock: https://www.mouser.com/Search/Refine.aspx?Keyword=80-T495X477K10ATE100; RS Part Number: 8015530P; RS Price/Stock: http://uk.rs-online.com/web/p/products/8015530P; Allied Price/Stock: https://www.alliedelec.com/kemet-t495x477k010ate100/70610894/
C33 C34 = 10u-35V: 35V; Price: 0.04
  C33: Value: 10u
  C34: Value: 1u
C35 C36#1 C37 = 470u-25V: 25V; Price: 0.15
  C35 C36#1: Value: 470uF 25V
  C37: Value: 470uF/25V
C36#2 C38 = SMD_CHIP_CAP_CER_0603_TO_1206
D1 = CMP-2000-05906-1: Schottky Barrier Rectifier / , 50 V, 5 A, -55 to 150 degC, 2-Pin SMD, RoHS, Tape and Reel; Unit Weight: 0.007408oz; Configuration: Single; Vrrm - Repetitive Reverse Voltage: 50V; Vf - Forward Voltage: 0.7V; If - Forward Current: 5A; Brand: DiodesIncorporated; Ifsm - Forward Surge Current: 100A; Ir - Reverse Current: 500uA; Datasheet URL: http://www.diodes.com/_files/datasheets/ds13012.pdf; Package Description: 2-Pin Surface Mount Device, Body 6.855 x 5.905 mm; Length: 7.11mm; Operating Temperature Range: -55Cto+125C; Series: B550; Mounting Style: SMD/SMT; Termination Style: SMD/SMT; Factory Pack Quantity: 3000; Packaging: Reel; Minimum Operating Temperature: -55C; Mounting Technology: SurfaceMount; RoHS: True; Manufacturer URL: http://www.diodes.com/; Width: 6.22mm; Technology: Si; Maximum Operating Temperature: +125C; Product Category: SchottkyDiodes&Rectifiers; Height: 2.5mm; Datasheet Version: Rev. 17-2, 07/2015; Package Reference: SMC; Product: SchottkyDiodes; Type: SchottkyBarrierRectifier; Manufacturer: DiodesIncorporated; Package / Case: SMC
H16 H17 = MKDS 1,5 2-5,08: PCB terminal block, nominal current: 17.5 A, nom. voltage: 400 V, pitch: 5.08 mm
L3 = CHIP_FERRITE_BEAD_INDUCTOR_1206: Chip Ferrite Bead Inductor
L4 = CMP-2000-07148-1: Shielded SMD Power Inductor, 33 uH, +/- 20%, -40 to 125 degC, 2-Pin SMD, RoHS, Tape and Reel; Manufacturer: Bourns; PartNumber: SRR1280; DC Resistance Max: 57MOhm; Maximum Self Resonant Frequency: 9.5MHz; DC Current Max: 3.5A; Inductance: 33000nH; Core Material: Ferrite; Minimum Quality Factor: 28; Maximum DC Resistance: 57mΩ; Datasheet Version: Rev. 03/15, 03/2015; Manufacturer URL: http://www.bourns.com/; Datasheet URL: http://www.bourns.com/docs/Product-Datasheets/SRR1280.pdf; Minimum Operating Temperature: -40°C; Package Description: 2-Pin Surface Mount Device, Body 12.5 x 12.5 mm; Maximum Operating Temperature: +125°C; Tolerance: 20%; Series: SRR1280; Package URL: http://www.bourns.com/docs/Product-Datasheets/SRR1280.pdf; Package Reference: SRR1280-2; Mounting Technology: SurfaceMount; Maximum DC Current: 3.5A
R34 R35 = R-0.25W: 0.25W 5% 250V; Price: 0.01; Value: 1 Ohm
U7 = CMP-0069-00269-3: SIMPLE SWITCHER® Power Converter 150 KHz 3A Step-Down Voltage Regulator, 5-pin TO-263, Pb-Free; Manufacturer: Texas Instruments; PowerWise: N; PackageTopMarking: NSUZXYTTE#*LM2596S*-5.0 P+; ComponentLink1URL: http://www.ti.com/general/docs/lit/getliterature.tsp?genericPartNumber=LM2596&fileType=pdf; PackageDescription: TO-263, Molded, .400 x .390 x .180in, 5 Lead, .067in Pitch, Surface Mount; RoHS: Y; PinCount: 5; Code_JEDEC: MO-169-AB; ComponentLink1Description: Datasheet URL; PackageReference: KTT0005B; CompType: Switcher
U6 = 7805: Price: 0.312

## Sheet MAX3232.SchDoc
size A
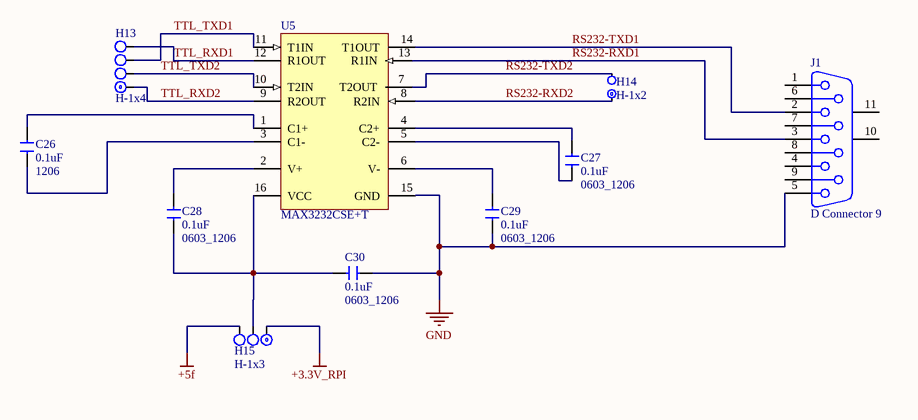
[diagram p5: MAX3232.SchDoc]

### Parts
C26  0.1uF  value 1206  [SMD_CHIP_Cap_Cer_1206]
C27  0.1uF  value 0603_1206  [SMD_CHIP_CAP_CER_0603_TO_1206]
C28  0.1uF  value 0603_1206  [SMD_CHIP_CAP_CER_0603_TO_1206]
C29  0.1uF  value 0603_1206  [SMD_CHIP_CAP_CER_0603_TO_1206]
C30  0.1uF  value 0603_1206  [SMD_CHIP_CAP_CER_0603_TO_1206]
H13  H-1x4  [J1x4]
H14  H-1x2  [J1x2]
H15  H-1x3  [J1x3]
J1  D Connector 9  [DB9-HEMBRA]
U5  MAX3232CSE+T  [MAXM-S16+1_M]

### Nets
+3.3V_RPI: H15.1
+5f: H15.3
GND: C29.2 C30.2 J1.5 U5.15(GND)
RS232-RXD1: J1.3 U5.13(R1IN)
RS232-RXD2: H14.1 U5.8(R2IN)
RS232-TXD1: J1.2 U5.14(T1OUT)
RS232-TXD2: H14.2 U5.7(T2OUT)
TTL_RXD1: H13.4 U5.12(R1OUT)
TTL_RXD2: H13.1 U5.9(R2OUT)
TTL_TXD1: H13.3 U5.11(T1IN)
TTL_TXD2: H13.2 U5.10(T2IN)
NetC26_1: C26.1 U5.1(C1+)
NetC26_2: C26.2 U5.3(C1-)
NetC27_1: C27.1 U5.4(C2+)
NetC27_2: C27.2 U5.5(C2-)
NetC28_1: C28.1 U5.2(V+)
NetC28_2: C28.2 C30.1 H15.2 U5.16(VCC)
NetC29_1: C29.1 U5.6(V-)

Not connected (* = marked no-connect by the designer): J1 1 4 6 7 8 9 10(MH1) 11(MH2)

### Library data of the parts
C26 = SMD_CHIP_CAP_CER_1206
C27-C30 = SMD_CHIP_CAP_CER_0603_TO_1206
J1 = D Connector 9: Receptacle Assembly, 9 Position, Right Angle; PackageDocument: O; Positions: 9; Published: 15-Jun-2001; LatestRevisionDate: 17-Jul-2002; LatestRevisionNote: Re-released for DXP Platform.; DatasheetDocument: 1-Sep-1999; PackageReference: 788750; Publisher: Altium Limited; Orientation: Right Angle; Gender: Receptacle
U5 = CMP-2000-06662-1: Low-Power, True RS-232 Transceivers Using Four 0.1 uF External Capacitor, up to 1 Mbps, 3.0 to 5.5 V, 0 to 70 degC, 16-Pin SOIC (S16+1), RoHS, Tape and Reel; Shutdown: No; Data Rate: 235kbps; Brand: MaximIntegrated; Number of Receivers: 2Receiver; Supply Current: 1mA; Number of Drivers: 2Driver; Operating Supply Voltage: 3Vto5.5V; Number of I/Os: 8; Propagation Delay Time ns: 0.3us; Package Version: Rev. G, 01/2016; Datasheet Version: Rev. 7, 01/2007; Package Description: 16-Pin Small Outline Integrated Circuit, Body 9.9 x 3.9 mm, Pitch 1.27 mm; Package / Case: SO-Narrow-16; Package Reference: S16+1; Package URL: http://pdfserv.maximintegrated.com/package_dwgs/21-0041.PDF; Function: Transceiver; Packaging: Reel; Manufacturer URL: http://www.maximintegrated.com/; Maximum Operating Temperature: +70C; Series: MAX3232; Datasheet URL: https://datasheets.maximintegrated.com/en/ds/MAX3222-MAX3241.pdf; Product Category: RS-232InterfaceIC; Operating Temperature Range: 0Cto+70C; Factory Pack Quantity: 2500; Mounting Style: SMD/SMT; Minimum Operating Temperature: 0C; Manufacturer: MaximIntegrated; Mounting Technology: SurfaceMount; RoHS: Details
H13 = H-1x4: Price: 0.04
H14 = H-1x2: Price: 0.02
H15 = H-1x3: Price: 0.03

## Nets that join several sheets
+3.3V_RPI: uController (H11.1 RPI1.1), MAX3232 (H15.1)
+5f: Sensores (L1.1 P3.1), uController (9 pins), SensorTemperatura (IC1.5 R10.2 R22.2 U2.4), PowerSupply (C31.1 L3.2), MAX3232 (H15.3)
GND: Sensores (6 pins), uController (27 pins), SensorTemperatura (13 pins), Relay (Q1.1 Q2.1), PowerSupply (15 pins), MAX3232 (C29.2 C30.2 J1.5 U5.15)
PT100_AN_READ: uController (U4.24), SensorTemperatura (IC1.1 IC1.4)
RELAY1: uController (H6.1 U4.14), Relay (R36.2)
RELAY2: uController (H6.2 U4.15), Relay (R37.2)
RPM_SENSOR: Sensores (C9.2 R7.1), uController (U4.4)
SCL: Sensores (U1.10), uController (DS1.16 R26.1 U4.28)
SDA: Sensores (U1.9), uController (DS1.15 R25.1 U4.27)
ZMPT101B_VOLT_SENSOR: Sensores (C8.2 R6.1), uController (U4.23)